# EAGLE design msp432_breakout_hm10 (EAGLE 7.5.0)
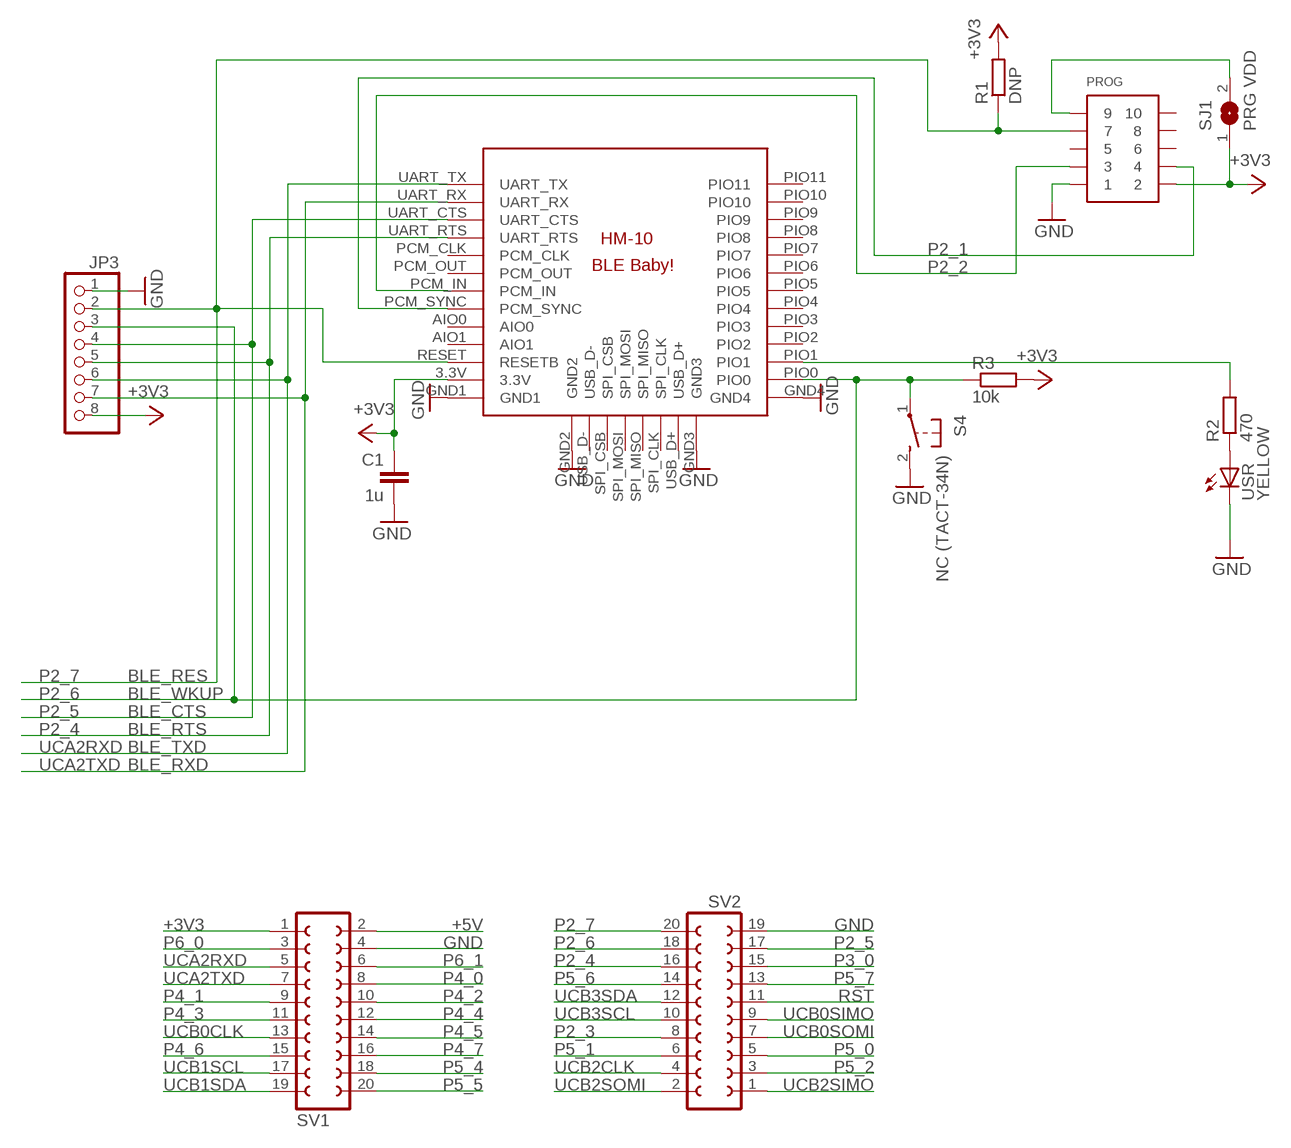
[diagram p0: schematic, sheet 1]

## Parts
C1  1u  C-EUC0603  [C0603]
JP3  PINHD-1X8  [1X08]
PROG  CONN_5-2-FTSH-V  [FTSH-105-DV]
R1  DNP  R-EU_R0603  [R0603]
R2  470  R-EU_R0603  [R0603]
R3  10k  R-EU_R0603  [R0603]
S4  NC (TACT-34N)  TACT-34N  [TACT-34N]
SJ1  PRG VDD  SJ  [SJ]
SV1  FE10-2  [FE10-2]
SV2  FE10-2  [FE10-2]
U$1  BLE-HM-10  [BLE-HM-10]
USR  YELLOW  LEDCHIPLED_0805  [CHIPLED_0805]

## Nets
+3V3: C1.1 JP3.8 PROG.2 R1.2 R3.2 SJ1.1 SV1.1 U$1.3.3V
+5V: SV1.2
GND [power]: C1.2 JP3.1 PROG.1 S4.2(S) SV1.4 SV2.19 U$1.GND1 U$1.GND2 U$1.GND3 U$1.GND4 USR.C
N$2: R2.1 USR.A
N$5: R2.2 U$1.PIO1
N$27: PROG.9 SJ1.2
P2_1: PROG.4 U$1.PCM_SYNC
P2_2: PROG.3 U$1.PCM_IN
P2_3: SV2.8
P2_4: JP3.5 SV2.16 U$1.UART_RTS
P2_5: JP3.4 SV2.17 U$1.UART_CTS
P2_6: JP3.3 R3.1 S4.1(P) SV2.18 U$1.PIO0
P2_7: JP3.2 PROG.7 R1.1 SV2.20 U$1.RESET(RESETB)
P3_0: SV2.15
P4_0: SV1.8
P4_1: SV1.9
P4_2: SV1.10
P4_3: SV1.11
P4_4: SV1.12
P4_5: SV1.14
P4_6: SV1.15
P4_7: SV1.16
P5_0: SV2.5
P5_1: SV2.6
P5_2: SV2.3
P5_4: SV1.18
P5_5: SV1.20
P5_6: SV2.14
P5_7: SV2.13
P6_0: SV1.3
P6_1: SV1.6
RST: SV2.11
UCA2RXD: JP3.6 SV1.5 U$1.UART_TX
UCA2TXD: JP3.7 SV1.7 U$1.UART_RX
UCB0CLK: SV1.13
UCB0SIMO: SV2.9
UCB0SOMI: SV2.7
UCB1SCL: SV1.17
UCB1SDA: SV1.19
UCB2CLK: SV2.4
UCB2SIMO: SV2.1
UCB2SOMI: SV2.2
UCB3SCL: SV2.10
UCB3SDA: SV2.12
Unconnected: PROG.5 PROG.6 PROG.8 PROG.10 U$1.AIO0 U$1.AIO1 U$1.PCM_CLK U$1.PCM_OUT U$1.PIO2 U$1.PIO3 U$1.PIO4 U$1.PIO5 U$1.PIO6 U$1.PIO7 U$1.PIO8 U$1.PIO9 U$1.PIO10 U$1.PIO11 U$1.SPI_CLK U$1.SPI_CSB U$1.SPI_MISO U$1.SPI_MOSI U$1.USB_D+ U$1.USB_D-

## Notes on the sheet
- BLE_RES
- BLE_WKUP
- BLE_CTS
- BLE_RTS
- BLE_TXD
- BLE_RXD

## Library data of the parts
C1 = rcl:C-EU: CAPACITOR, European symbol
JP3 = pinhead:PINHD-1X8: PIN HEADER
PROG = pel_misc:CONN_5-2
R1-R3 = rcl:R-EU_: RESISTOR, European symbol
S4 = hvac:TACT-34N
SJ1 = jumper:SJ: SMD solder JUMPER
SV1 SV2 = con-lsta:FE10-2: FEMALE HEADER; OC_FARNELL: unknown; OC_NEWARK: unknown
U$1 = Random parts:BLE-HM-10
USR = led:LED: LED OSRAM: - CHIPLED LG R971, LG N971, LY N971, LG Q971, LY Q971, LO R971, LY R971 LH N974, LH R974 LS Q976, LO Q976, LY Q976 LO Q996 - Hyper CHIPLED LW Q18S LB Q993, LB Q99A, LB R99A - SideLED LS A670, LO A670, LY A670, LG A670, LP A670 LB A673, LV A673, LT A673, LW A673 LH A674 LY A675 LS A676, LA A676, LO A676, LY A676, LW A676 LS A679, LY A679, LG A679 - Hyper Micro SIDELED® LS Y876, LA Y876, LO Y876, LY Y876 LT Y87S - SmartLED LW L88C, LW L88S LB L89C, LB L89S, LG L890 LS L89K, LO L89K, LY L89K LS L896, LA L896, LO L896, LY L896 - TOPLED LS T670, LO T670, LY T670, LG T670, LP T670 LSG T670, LSP T670, LSY T670, LOP T670, LYG T670 LG T671, LOG T671, LSG T671 LB T673, LV T673, LT T673, LW T673 LH T674 LS T676, LA T676, LO T676, LY T676, LB T676, LH T676, LSB T676, LW T676 LB T67C, LV T67C, LT T67C, LS T67K, LO T67K, LY T67K, LW E67C LS E67B, LA E67B, LO E67B, LY E67B, LB E67C, LV E67C, LT E67C LW T67C LS T679, LY T679, LG T679 LS T770, LO T770, LY T770, LG T770, LP T770 LB T773, LV T773, LT T773, LW T773 LH T774 LS E675, LA E675, LY E675, LS T675 LS T776, LA T776, LO T776, LY T776, LB T776 LHGB T686 LT T68C, LB T68C - Hyper Mini TOPLED® LB M676 - Mini TOPLED Santana® LG M470 LS M47K, LO M47K, LY M47K Source: http://www.osram.convergy.de LUXEON: - LUMILED® LXK2-PW12-R00, LXK2-PW12-S00, LXK2-PW14-U00, LXK2-PW14-V00 LXK2-PM12-R00, LXK2-PM12-S00, LXK2-PM14-U00 LXK2-PE12-Q00, LXK2-PE12-R00, LXK2-PE12-S00, LXK2-PE14-T00, LXK2-PE14-U00 LXK2-PB12-K00, LXK2-PB12-L00, LXK2-PB12-M00, LXK2-PB14-N00, LXK2-PB14-P00, LXK2-PB14-Q00 LXK2-PR12-L00, LXK2-PR12-M00, LXK2-PR14-Q00, LXK2-PR14-R00 LXK2-PD12-Q00, LXK2-PD12-R00, LXK2-PD12-S00 LXK2-PH12-R00, LXK2-PH12-S00 LXK2-PL12-P00, LXK2-PL12-Q00, LXK2-PL12-R00 Source: www.luxeon.com KINGBRIGHT: KA-3528ASYC Source: www.kingbright.com

## Net classes
1 power: width 0.254 mm, drill 0.33 mm, clearance 0.152 mm

## Board
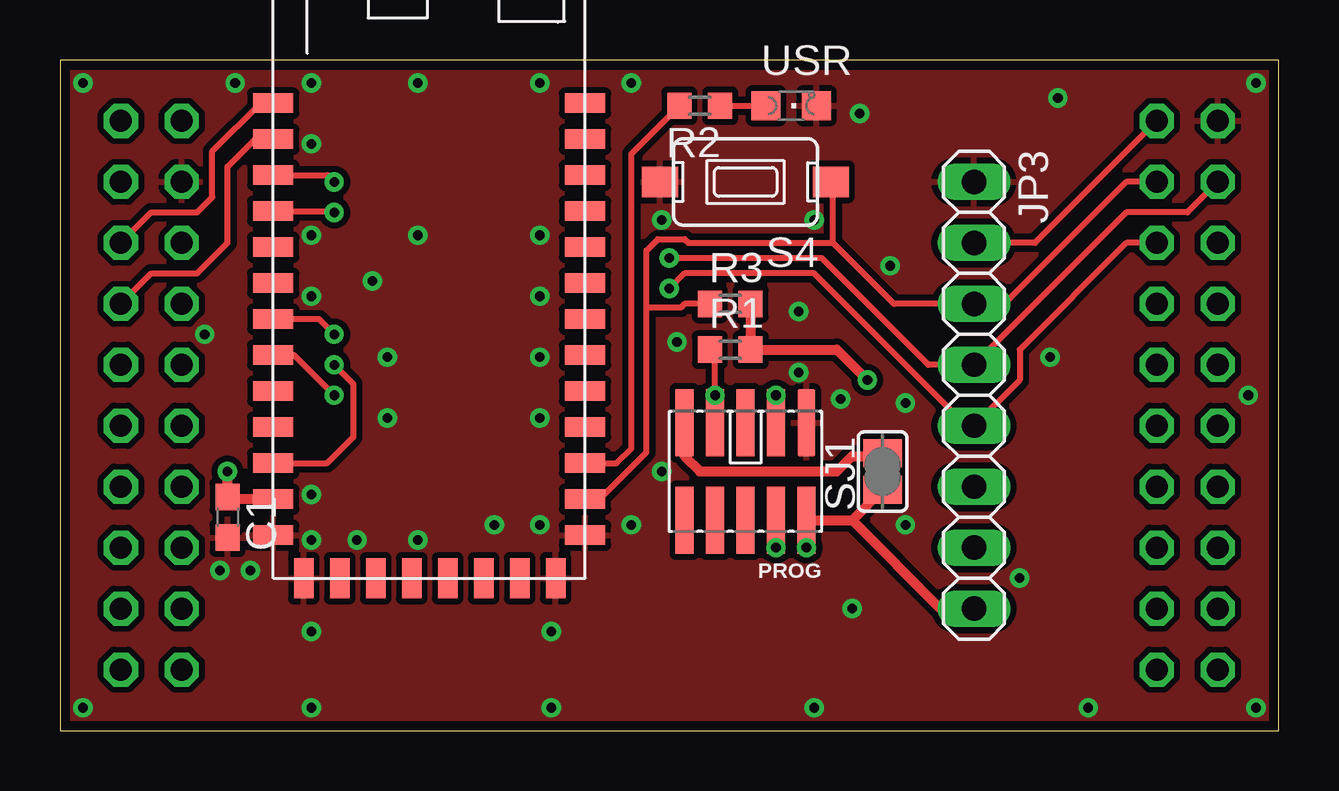
[diagram p1: board, top side]
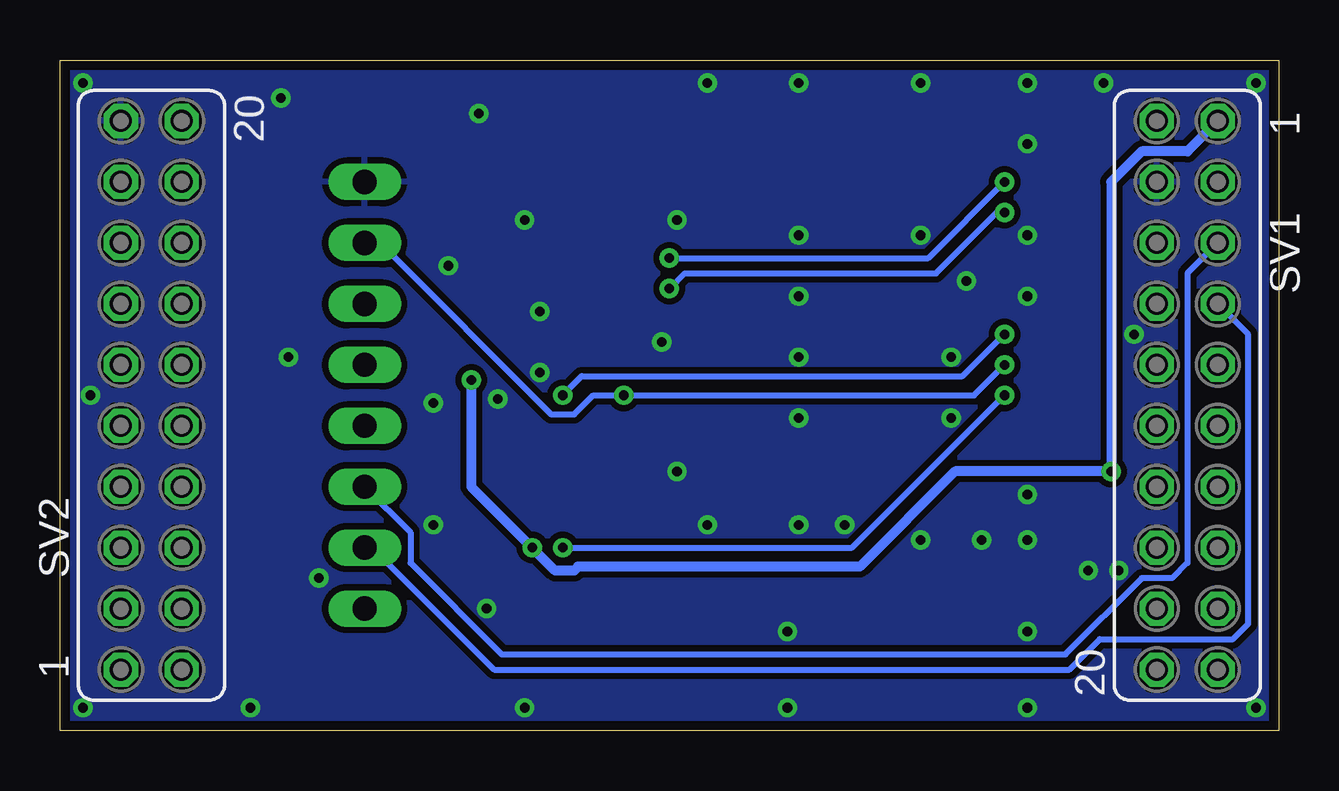
[diagram p2: board, bottom side, seen from below]

Size 50.8 x 27.94 mm. Coordinates in mm from the lower left corner, seen from the top.
Outline: 0,27.94 0,0 50.8,0 50.8,27.94 0,27.94
Copper layers (1*16): Top 0.035mm / dielectric 1.5mm / Bottom 0.035mm
Design rules "default *": minimum track width 10mil, minimum drill 0.4mm, track to track 8mil, track to pad 8mil, pad to pad 8mil, via to via 8mil, smd to smd 0mil, copper to edge 16mil, drill to drill 8mil, minimum pad ring 10mil, minimum via ring 8mil, stop-mask expansion 4mil, vias tented up to drill 0.4mm, thermal gap 10mil

### Footprints (pad centres in the part's own frame; a part is rotated, then mirrored left to right if it is on the bottom)
C0603 = smd 1.1 x 1: 1 -0.85,0; 2 0.85,0
1X08 = drill 1.016 long: 1 -8.89,0; 2 -6.35,0; 3 -3.81,0; 4 -1.27,0; 5 1.27,0; 6 3.81,0; 7 6.35,0; 8 8.89,0
FTSH-105-DV = smd 0.74 x 2.8: 1 -2.54,-2.03; 2 -2.54,2.03; 3 -1.27,-2.03; 4 -1.27,2.03; 5 0,-2.03; 6 0,2.03; 7 1.27,-2.03; 8 1.27,2.03; 9 2.54,-2.03; 10 2.54,2.03
R0603 = smd 1 x 1.1: 1 -0.85,0; 2 0.85,0
TACT-34N = smd 1.5 x 1.27: 1 -3.556,0; 2 3.556,0
SJ = smd 1.168 x 1.6: 1 -0.762,0; 2 0.762,0
FE10-2 = drill 0.914 octagon: 1 -11.43,1.27; 2 -11.43,-1.27; 3 -8.89,1.27; 4 -8.89,-1.27; 5 -6.35,1.27; 6 -6.35,-1.27; 7 -3.81,1.27; 8 -3.81,-1.27; 9 -1.27,1.27; 10 -1.27,-1.27; 11 1.27,1.27; 12 1.27,-1.27; 13 3.81,1.27; 14 3.81,-1.27; 15 6.35,1.27; 16 6.35,-1.27; 17 8.89,1.27; 18 8.89,-1.27; 19 11.43,1.27; 20 11.43,-1.27
BLE-HM-10 = smd 1.676 x 0.813: 3.3V 0,3.29; AIO0 0,7.79; AIO1 0,6.29; GND1 0,1.79; GND4 13,1.79; PCM_CLK 0,13.79; PCM_IN 0,10.79; PCM_OUT 0,12.29; PCM_SYNC 0,9.29; PIO0 13,3.29; PIO1 13,4.79; PIO2 13,6.29; PIO3 13,7.79; PIO4 13,9.29; PIO5 13,10.79; PIO6 13,12.29; PIO7 13,13.79; PIO8 13,15.29; PIO9 13,16.79; PIO10 13,18.29; PIO11 13,19.79; RESET 0,4.79; UART_CTS 0,16.79; UART_RTS 0,15.29; UART_RX 0,18.29; UART_TX 0,19.79 | smd 0.813 x 1.676: GND2 1.27,0; GND3 11.77,0; SPI_CLK 8.77,0; SPI_CSB 4.27,0; SPI_MISO 7.27,0; SPI_MOSI 5.77,0; USB_D+ 10.27,0; USB_D- 2.77,0
CHIPLED_0805 = smd 1.2 x 1.2: A 0,-1.05; C 0,1.05

### Placement (x,y rotation side)
C1  6.99,8.89 270 top
JP3  38.1,13.97 270 top
PROG  28.57,10.79 180 top
R1  27.94,15.88 0 top
R2  26.67,26.04 180 top
R3  27.94,17.78 0 top
S4  28.57,22.86 180 top
SJ1  34.29,10.79 90 top
SV1  3.81,13.97 270 bottom
SV2  46.99,13.97 90 bottom
U$1  8.89,6.35 0 top
USR  30.48,26.04 270 top

### Tracks (layer width: path | path; a pad name or v marks a point on that pad's centre or on a via)
+3V3  (via drill 0.4)
  Top 0.406: v31.11,7.62 PROG.2 33.02,8.77 | 33.02,8.77 SJ1.1 34.32,10 | U$1.3.3V 7.08,9.64 C1.1 v6.99,10.79 | JP3.8 36.71,5.08 33.02,8.77 | R3.2 R1.2 32.38,15.88 v33.66,14.61
  Bottom 0.406: SV1.1 3.81,24.13 5.71,24.13 6.99,22.86 v6.99,10.79 13.49,10.79 17.46,6.83 29.21,6.83 29.37,6.67 30.16,6.67 v31.11,7.62 33.66,10.16 v33.66,14.61
GND  (via drill 0.4)
  other vias: 0.95,26.99 49.85,26.99 49.85,0.95 0.95,0.95 41.27,15.56 40.01,6.35 10.48,7.94 12.38,7.94 20,13.02 20,8.57 18.1,8.57 13.65,13.02 10.48,9.84 14.92,7.94 13.65,15.56 20,15.56 10.48,20.64 10.48,18.1 13.02,18.73 20,18.1 20,20.64 14.92,20.64 10.48,24.45 10.48,26.99 20,26.99 7.3,26.99 23.81,26.99 14.92,26.99 6.03,16.51 6.67,6.67 7.94,6.67 10.48,4.13 20.48,4.13 33.02,5.08 10.48,0.95 20.48,0.95 31.43,0.95 42.86,0.95 35.24,8.57 35.24,13.65 30.8,17.46 30.8,14.92 32.54,13.81 23.81,8.57 25.08,10.79 25.72,16.19 34.61,19.37 25.08,21.27 31.43,21.27 33.34,25.72 41.59,26.35 49.53,13.97
  pour Top (isolate 0.254): 0,27.94 50.8,27.94 50.8,0 0,0
  pour Bottom (isolate 0.254): 0,27.94 50.8,27.94 50.8,0 0,0
N$2
  Top 0.254: R2.1 USR.A
N$5
  Top 0.254: U$1.PIO1 23.2,11.14 23.81,11.75 23.81,24.03 R2.2
N$27
  Top 0.406: PROG.9 26.04,11.43 26.67,10.79 32.38,10.79 33.02,11.43 34.16,11.43 SJ1.2
P2_1  (via drill 0.4)
  Top 0.254: PROG.4 v29.84,7.62 | U$1.PCM_SYNC 9.76,15.64 v11.43,13.97
  Bottom 0.254: v29.84,7.62 17.78,7.62 v11.43,13.97
P2_2  (via drill 0.4)
  Top 0.254: PROG.3 v29.84,13.97 | v11.43,16.51 10.79,17.14 U$1.PCM_IN
  Bottom 0.254: v29.84,13.97 29.05,14.76 13.18,14.76 v11.43,16.51
P2_4  (via drill 0.4)
  Top 0.254: SV2.16 44.45,20.32 40.01,15.88 40.01,14.61 JP3.5 37.78,12.7 31.43,19.05 26.04,19.05 v25.4,18.41 | U$1.UART_RTS 11.38,21.64 v11.43,21.59
  Bottom 0.254: v25.4,18.41 24.77,19.05 14.29,19.05 11.75,21.59 v11.43,21.59
P2_5  (via drill 0.4)
  Top 0.254: SV2.17 46.99,21.59 44.45,21.59 JP3.4 36.2,15.24 31.75,19.68 v25.4,19.68 | U$1.UART_CTS 11.15,23.14 v11.43,22.86
  Bottom 0.254: v25.4,19.68 14.61,19.68 v11.43,22.86
P2_6
  Top 0.254: SV2.18 44.45,22.86 39.37,17.78 JP3.3 34.77,17.78 32.23,20.32 | U$1.PIO0 22.5,9.64 24.45,11.59 24.45,17.62 | 24.45,17.62 24.45,20 24.92,20.48 26.04,20.48 26.19,20.32 32.23,20.32 | R3.1 26.04,17.78 25.88,17.62 24.45,17.62 | 32.23,20.32 32.23,22.77 S4.1
P2_7  (via drill 0.4)
  Top 0.254: SV2.20 40.64,20.32 JP3.2 | PROG.7 v27.3,13.97 27.3,15.66 R1.1 | v11.43,15.24 12.22,14.45 12.22,12.22 11.14,11.14 U$1.RESET
  Bottom 0.254: v11.43,15.24 12.7,13.97 v27.3,13.97 28.57,13.97 29.37,13.18 30.32,13.18 37.47,20.32 JP3.2
UCA2RXD
  Top 0.254: SV1.5 3.81,21.59 5.71,21.59 6.35,22.23 6.35,24.13 8.36,26.14 U$1.UART_TX
  Bottom 0.254: JP3.6 36.2,8.26 36.2,6.99 32.38,3.17 8.89,3.17 5.71,6.35 4.45,6.35 3.81,6.99 3.81,19.05 SV1.5
UCA2TXD
  Top 0.254: SV1.7 3.81,19.05 5.71,19.05 6.99,20.32 6.99,23.5 8.13,24.64 U$1.UART_RX
  Bottom 0.254: JP3.7 37.78,7.62 32.7,2.54 8.73,2.54 7.46,3.81 1.91,3.81 1.27,4.45 1.27,16.51 SV1.7

### Text on the board
potisk: v1/ | 2016 | GND | RES | BTN | CTS | RTS | TXD | RXD | 3V3 | HM-10 breakout | for MSP432 | DREL